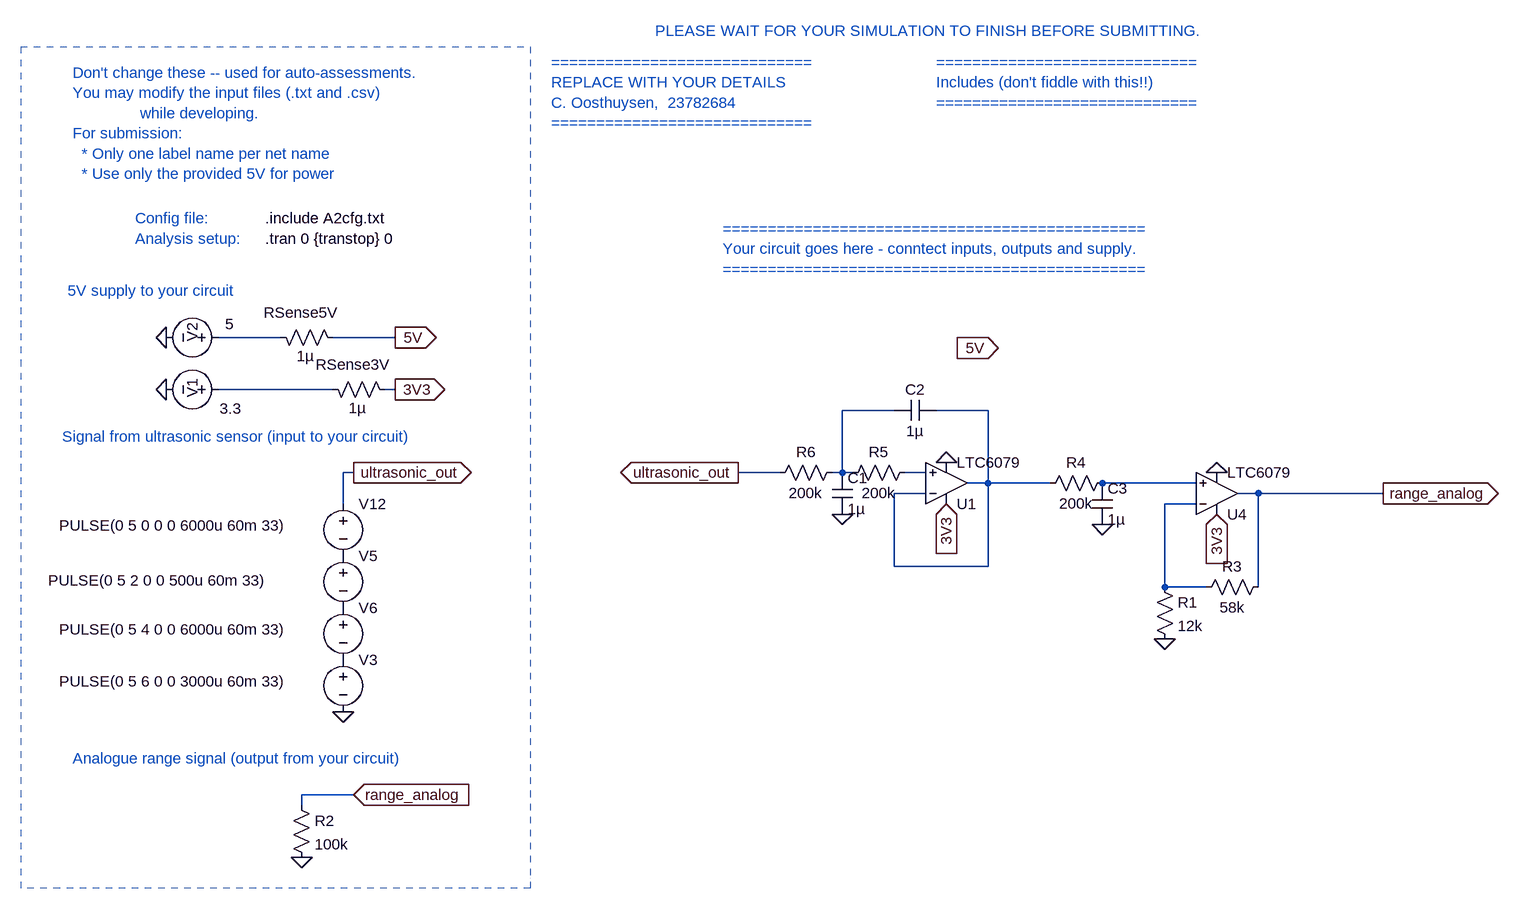
[diagram p0: schematic E344_Ass2_US2A.asc]
E344_Ass2_US2A.asc, the LTspice schematic file:
Version 4
SHEET 1 3140 2124
WIRE -1968 -976 -2064 -976
WIRE -1792 -976 -1888 -976
WIRE -1888 -896 -2064 -896
WIRE -1792 -896 -1808 -896
WIRE -1024 -864 -1104 -864
WIRE -880 -864 -960 -864
WIRE -1856 -768 -1872 -768
WIRE -1200 -768 -1264 -768
WIRE -1104 -768 -1104 -864
WIRE -1104 -768 -1120 -768
WIRE -1088 -768 -1104 -768
WIRE -976 -768 -1008 -768
WIRE -1104 -752 -1104 -768
WIRE -880 -752 -880 -864
WIRE -880 -752 -912 -752
WIRE -784 -752 -880 -752
WIRE -560 -752 -704 -752
WIRE -976 -736 -1024 -736
WIRE -464 -736 -496 -736
WIRE -272 -736 -464 -736
WIRE -1872 -720 -1872 -768
WIRE -560 -720 -608 -720
WIRE -1024 -624 -1024 -736
WIRE -880 -624 -880 -752
WIRE -880 -624 -1024 -624
WIRE -608 -592 -608 -720
WIRE -544 -592 -608 -592
WIRE -464 -592 -464 -736
WIRE -1856 -272 -1936 -272
WIRE -1936 -256 -1936 -272
FLAG -1792 -976 5V
IOPIN -1792 -976 Out
FLAG -2144 -976 0
FLAG -864 -960 5V
IOPIN -864 -960 In
FLAG -1872 -400 0
FLAG -1856 -768 ultrasonic_out
IOPIN -1856 -768 Out
FLAG -1264 -768 ultrasonic_out
IOPIN -1264 -768 Out
FLAG -272 -736 range_analog
IOPIN -272 -736 Out
FLAG -1856 -272 range_analog
IOPIN -1856 -272 In
FLAG -1936 -176 0
FLAG -1792 -896 3V3
IOPIN -1792 -896 Out
FLAG -2144 -896 0
FLAG -944 -720 3V3
IOPIN -944 -720 In
FLAG -528 -704 3V3
IOPIN -528 -704 In
FLAG -944 -784 0
FLAG -1104 -704 0
FLAG -528 -768 0
FLAG -608 -512 0
FLAG -704 -688 0
SYMBOL voltage -2048 -976 R90
WINDOW 123 0 0 Left 0
WINDOW 39 0 0 Left 0
WINDOW 0 -23 56 Left 2
WINDOW 3 -21 -8 VRight 2
SYMATTR InstName V2
SYMATTR Value 5
SYMBOL res -1984 -992 M90
WINDOW 0 -7 47 VBottom 2
WINDOW 3 29 54 VTop 2
SYMATTR InstName RSense5V
SYMATTR Value 1µ
SYMBOL Opamps\\LTC6079 -528 -736 M180
SYMATTR InstName U4
SYMBOL voltage -1872 -736 R0
WINDOW 123 0 0 Left 0
WINDOW 39 0 0 Left 0
WINDOW 3 -437 49 Left 2
SYMATTR Value PULSE(0 5 0 0 0 6000u 60m 33)
SYMATTR InstName V12
SYMBOL voltage -1872 -656 R0
WINDOW 123 0 0 Left 0
WINDOW 39 0 0 Left 0
WINDOW 3 -454 54 Left 2
SYMATTR Value PULSE(0 5 2 0 0 500u 60m 33)
SYMATTR InstName V5
SYMBOL voltage -1872 -576 R0
WINDOW 123 0 0 Left 0
WINDOW 39 0 0 Left 0
WINDOW 3 -437 49 Left 2
SYMATTR Value PULSE(0 5 4 0 0 6000u 60m 33)
SYMATTR InstName V6
SYMBOL voltage -1872 -496 R0
WINDOW 123 0 0 Left 0
WINDOW 39 0 0 Left 0
WINDOW 3 -437 49 Left 2
SYMATTR Value PULSE(0 5 6 0 0 3000u 60m 33)
SYMATTR InstName V3
SYMBOL res -1952 -272 R0
SYMATTR InstName R2
SYMATTR Value 100k
SYMBOL voltage -2048 -896 R90
WINDOW 123 0 0 Left 0
WINDOW 39 0 0 Left 0
WINDOW 0 -17 56 Left 2
WINDOW 3 29 -20 VRight 2
SYMATTR InstName V1
SYMATTR Value 3.3
SYMBOL res -1904 -912 M90
WINDOW 0 -7 47 VBottom 2
WINDOW 3 29 54 VTop 2
SYMATTR InstName RSense3V
SYMATTR Value 1µ
SYMBOL Opamps\\LTC6079 -944 -752 M180
SYMATTR InstName U1
SYMBOL res -624 -608 R0
SYMATTR InstName R1
SYMATTR Value 12k
SYMBOL res -448 -608 R90
WINDOW 0 0 56 VBottom 2
WINDOW 3 32 56 VTop 2
SYMATTR InstName R3
SYMATTR Value 58k
SYMBOL res -688 -768 R90
WINDOW 0 0 56 VBottom 2
WINDOW 3 32 56 VTop 2
SYMATTR InstName R4
SYMATTR Value 200k
SYMBOL cap -1120 -768 R0
SYMATTR InstName C1
SYMATTR Value 1µ
SYMBOL cap -960 -880 R90
WINDOW 0 0 32 VBottom 2
WINDOW 3 32 32 VTop 2
SYMATTR InstName C2
SYMATTR Value 1µ
SYMBOL cap -720 -752 R0
SYMATTR InstName C3
SYMATTR Value 1µ
SYMBOL res -1104 -752 R270
WINDOW 0 32 56 VTop 2
WINDOW 3 0 56 VBottom 2
SYMATTR InstName R5
SYMATTR Value 200k
SYMBOL res -1104 -784 R90
WINDOW 0 0 56 VBottom 2
WINDOW 3 32 56 VTop 2
SYMATTR InstName R6
SYMATTR Value 200k
TEXT -1992 -1128 Left 2 !.tran 0 {transtop} 0
TEXT -1992 -1160 Left 2 !.include A2cfg.txt
TEXT -2288 -1384 Left 2 ;Don't change these -- used for auto-assessments.\nYou may modify the input files (.txt and .csv) \n               while developing.\nFor submission: \n  * Only one label name per net name\n  * Use only the provided 5V for power
TEXT -2192 -1160 Left 2 ;Config file:
TEXT -2192 -1128 Left 2 ;Analysis setup:
TEXT -1552 -1400 Left 2 ;=============================\nREPLACE WITH YOUR DETAILS\nC. Oosthuysen,  23782684\n=============================
TEXT -960 -1400 Left 2 ;=============================\nIncludes (don't fiddle with this!!)\n=============================
TEXT -1288 -1144 Left 2 ;===============================================\nYour circuit goes here - conntect inputs, outputs and supply.\n===============================================
TEXT -1392 -1448 Left 2 ;PLEASE WAIT FOR YOUR SIMULATION TO FINISH BEFORE SUBMITTING.
TEXT -2304 -824 Left 2 ;Signal from ultrasonic sensor (input to your circuit)
TEXT -2296 -1048 Left 2 ;5V supply to your circuit
TEXT -2288 -328 Left 2 ;Analogue range signal (output from your circuit)
LINE Normal -1584 -1424 -1584 -128 2
LINE Normal -2368 -1424 -1584 -1424 2
LINE Normal -1584 -128 -2368 -128 2
LINE Normal -1584 -144 -1584 -144 2
LINE Normal -2368 -1424 -2368 -128 2

The netlist it stands for:
* E344_Ass2_US2A.asc
V2 N001 0 5
RSense5V N001 5V 1µ
XU4 N006 N007 3V3 0 range_analog LTC6078  ; LTC6079, pins In+ In- V+ V- OUT
V12 ultrasonic_out P001 PULSE(0 5 0 0 0 6000u 60m 33)
V5 P001 P002 PULSE(0 5 2 0 0 500u 60m 33)
V6 P002 P003 PULSE(0 5 4 0 0 6000u 60m 33)
V3 P003 0 PULSE(0 5 6 0 0 3000u 60m 33)
R2 range_analog 0 100k
V1 N002 0 3.3
RSense3V N002 3V3 1µ
XU1 N005 N004 3V3 0 N004 LTC6078  ; LTC6079, pins In+ In- V+ V- OUT
R1 N007 0 12k
R3 range_analog N007 58k
R4 N006 N004 200k
C1 N003 0 1µ
C2 N004 N003 1µ
C3 N006 0 1µ
R5 N003 N005 200k
R6 N003 ultrasonic_out 200k
.tran 0 {transtop} 0
.include A2cfg.txt
* Don't change these -- used for auto-assessments.
* You may modify the input files (.txt and .csv)
*                while developing.
* For submission:
*   * Only one label name per net name
*   * Use only the provided 5V for power
* Config file:
* Analysis setup:
* =============================
* REPLACE WITH YOUR DETAILS
* C. Oosthuysen,  23782684
* =============================
* =============================
* Includes (don't fiddle with this!!)
* =============================
* ===============================================
* Your circuit goes here - conntect inputs, outputs and supply.
* ===============================================
* PLEASE WAIT FOR YOUR SIMULATION TO FINISH BEFORE SUBMITTING.
* Signal from ultrasonic sensor (input to your circuit)
* 5V supply to your circuit
* Analogue range signal (output from your circuit)
.lib LTC5.lib
.backanno
.end